# EAGLE design Conduino-V01 (EAGLE 8.5.2)
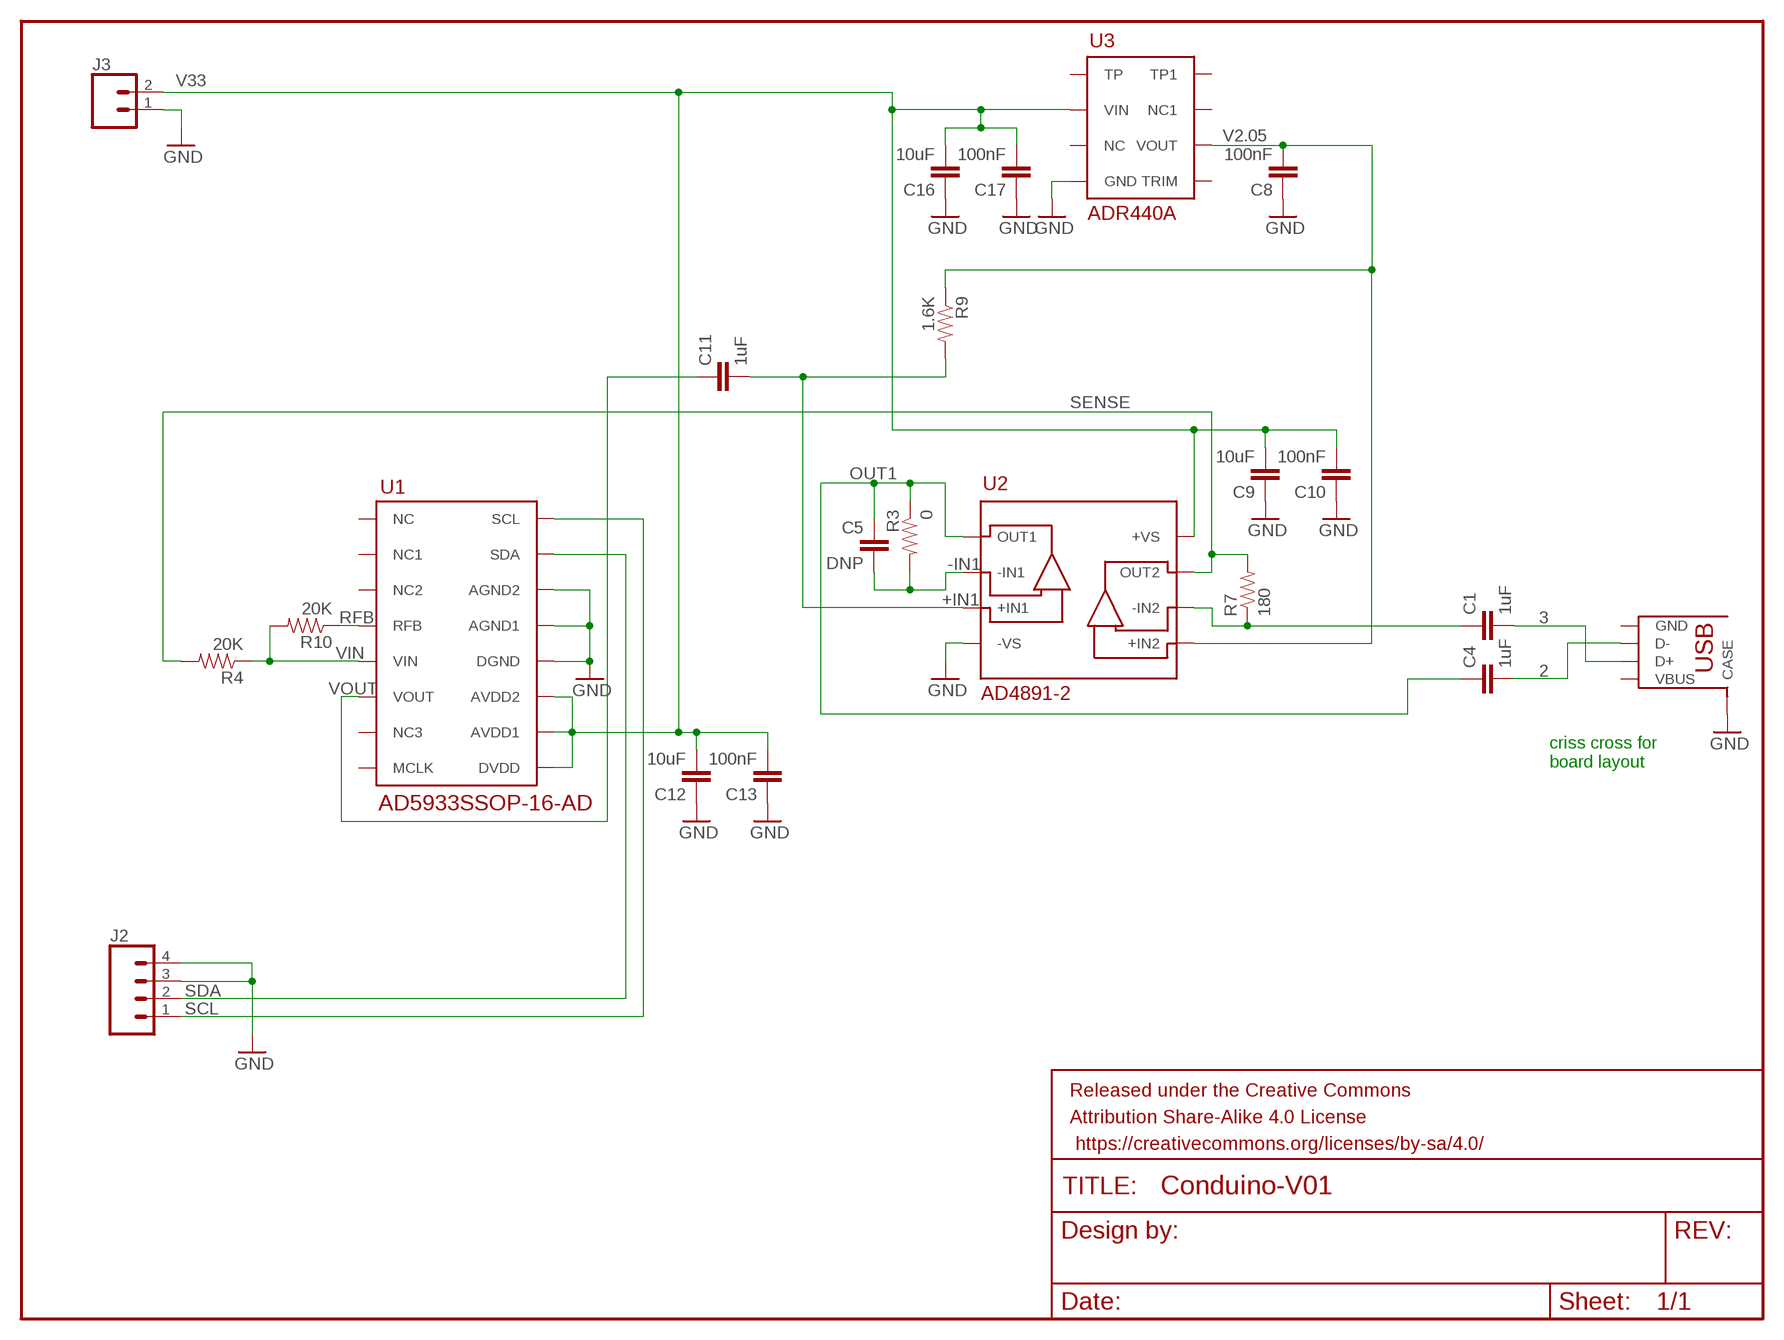
[diagram p0: schematic, sheet 1]

## Parts
C1  1uF  CAP0603-CAP  [0603-CAP]
C4  1uF  CAP0603-CAP  [0603-CAP]
C5  DNP  CAP0603-CAP  [0603-CAP]
C8  100nF  CAP0603-CAP  [0603-CAP]
C9  10uF  CAP0603-CAP  [0603-CAP]
C10  100nF  CAP0603-CAP  [0603-CAP]
C11  1uF  CAP0603-CAP  [0603-CAP]
C12  10uF  CAP0603-CAP  [0603-CAP]
C13  100nF  CAP0603-CAP  [0603-CAP]
C16  10uF  CAP0603-CAP  [0603-CAP]
C17  100nF  CAP0603-CAP  [0603-CAP]
FRAME1  FRAME-LETTER  [CREATIVE_COMMONS]
J1  USBA-SIDE  [USBA-SIDE]
J2  CONN_041X04_NO_SILK  [1X04_NO_SILK]
J3  CONN_021X02_NO_SILK  [1X02_NO_SILK]
R3  0  RESISTOR0603-RES  [0603-RES]
R4  20K  RESISTOR0603-RES  [0603-RES]
R7  180  RESISTOR0603-RES  [0603-RES]
R9  1.6K  RESISTOR0603-RES  [0603-RES]
R10  20K  RESISTOR0603-RES  [0603-RES]
U1  AD5933SSOP-16-AD  [SSOP-16-AD]
U2  AD4891-2  [SOIC_N]
U3  ADR440A  [SOIC_N]

## Nets
2: C4.2 J1.P$2(D-)
3: C1.2 J1.P$3(D+)
+IN1: C11.2 R9.2 U2.P$3(+IN1)
-IN1: C5.2 R3.2 U2.P$2(-IN1)
-IN2: C1.1 R7.1 U2.P$6(-IN2)
GND: C8.1 C9.1 C10.1 C12.1 C13.1 C16.1 C17.1 J1.P$5(CASE) J1.P$6(CASE) J2.3 J2.4 J3.1 U1.P$12(DGND) U1.P$13(AGND1) U1.P$14(AGND2) U2.P$4(-VS) U3.P$4(GND)
OUT1: C4.1 C5.1 R3.1 U2.P$1(OUT1)
RFB: R10.1 U1.P$4(RFB)
SCL: J2.1 U1.P$16(SCL)
SDA: J2.2 U1.P$15(SDA)
SENSE: R4.2 R7.2 U2.P$7(OUT2)
V2.05: C8.2 R9.1 U2.P$5(+IN2) U3.P$6(VOUT)
V33: C9.2 C10.2 C12.2 C13.2 C16.2 C17.2 J3.2 U1.P$9(DVDD) U1.P$10(AVDD1) U1.P$11(AVDD2) U2.P$8(+VS) U3.P$2(VIN)
VIN: R4.1 R10.2 U1.P$5(VIN)
VOUT: C11.1 U1.P$6(VOUT)
Unconnected: J1.P$1(GND) J1.P$4(VBUS) U1.P$1(NC) U1.P$2(NC1) U1.P$3(NC2) U1.P$7(NC3) U1.P$8(MCLK) U3.P$1(TP) U3.P$3(NC) U3.P$5(TRIM) U3.P$7(NC1) U3.P$8(TP1)

## Notes on the sheet
- criss cross for 
  board layout

## Library data of the parts
C1 C4 C5 C8-C13 C16 C17 = SparkFun-Passives:CAP: Capacitor Standard 0603 ceramic capacitor, and 0.1" leaded capacitor.
FRAME1 = SparkFun-Aesthetics:FRAME-LETTER: Schematic Frame Standard 8.5x11 US Letter frame
J1 = KDA:USBA-SIDE
J2 = SparkFun-Connectors:CONN_04: Multi connection point. Often used as Generic Header-pin footprint for 0.1 inch spaced/style header connections On any of the 0.1 inch spaced packages, you can populate with these: Break Away Headers - Straight <https://www.sparkfun.com/products/116> (PRT-00116) Break Away Male Headers - Right Angle <https://www.sparkfun.com/products/553> (PRT-00553) Female Headers <https://www.sparkfun.com/products/115> (PRT-00115) Break Away Headers - Machine Pin <https://www.sparkfun.com/products/117> (PRT-00117) Break Away Female Headers - Swiss Machine Pin <https://www.sparkfun.com/products/743> (PRT-00743) For SCREWTERMINALS and SPRING TERMINALS visit here: Screw Terimnals on SparkFun.com <https://www.sparkfun.com/search/results?term=Screw+Terminals> (5mm/3.5mm/2.54mm spacing) This device is also useful as a general connection point to wire up your design to another part of your project. Our various solder wires solder well into these plated through hole pads. Hook-Up Wire - Assortment (Stranded, 22 AWG) <https://www.sparkfun.com/products/11375> (PRT-11375) Hook-Up Wire - Assortment (Solid Core, 22 AWG) <https://www.sparkfun.com/products/11367> (PRT-11367) View the entire wire category on our website here <https://www.sparkfun.com/categories/141> Special notes: Molex polarized connector foot print use with SKU : PRT-08231 with associated crimp pins and housings. 1MM SMD Version SKU: PRT-10208; PROD_ID: CONN-09696
J3 = SparkFun-Connectors:CONN_02: Multi connection point. Often used as Generic Header-pin footprint for 0.1 inch spaced/style header connections On any of the 0.1 inch spaced packages, you can populate with these: Break Away Headers - Straight <https://www.sparkfun.com/products/116> (PRT-00116) Break Away Male Headers - Right Angle <https://www.sparkfun.com/products/553> (PRT-00553) Female Headers <https://www.sparkfun.com/products/115> (PRT-00115) Break Away Headers - Machine Pin <https://www.sparkfun.com/products/117> (PRT-00117) Break Away Female Headers - Swiss Machine Pin <https://www.sparkfun.com/products/743> (PRT-00743) For SCREWTERMINALS and SPRING TERMINALS visit here: Screw Terimnals on SparkFun.com <https://www.sparkfun.com/search/results?term=Screw+Terminals> (5mm/3.5mm/2.54mm spacing) This device is also useful as a general connection point to wire up your design to another part of your project. Our various solder wires solder well into these plated through hole pads. Hook-Up Wire - Assortment (Stranded, 22 AWG) <https://www.sparkfun.com/products/11375> (PRT-11375) Hook-Up Wire - Assortment (Solid Core, 22 AWG) <https://www.sparkfun.com/products/11367> (PRT-11367) View the entire wire category on our website here <https://www.sparkfun.com/categories/141> Special notes: Molex polarized connector foot print use with: PRT-08233 with associated crimp pins and housings. 2.54_SCREWTERM for use with PRT-10571. 3.5mm Screw Terminal footprints for PRT-08084 5mm Screw Terminal footprints for use with PRT-08432
R3 R4 R7 R9 R10 = SparkFun-Passives:RESISTOR: Resistor Basic schematic elements and footprints for 0603, 1206, and PTH resistors.
U1 = KDA:AD5933
U2 = KDA:AD4891-2
U3 = KDA:ADR440A

## Board
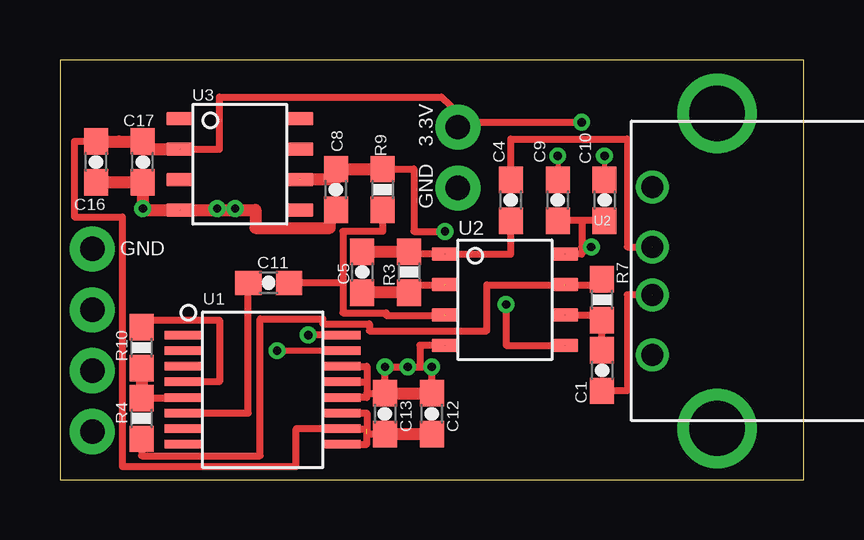
[diagram p1: board, top side]
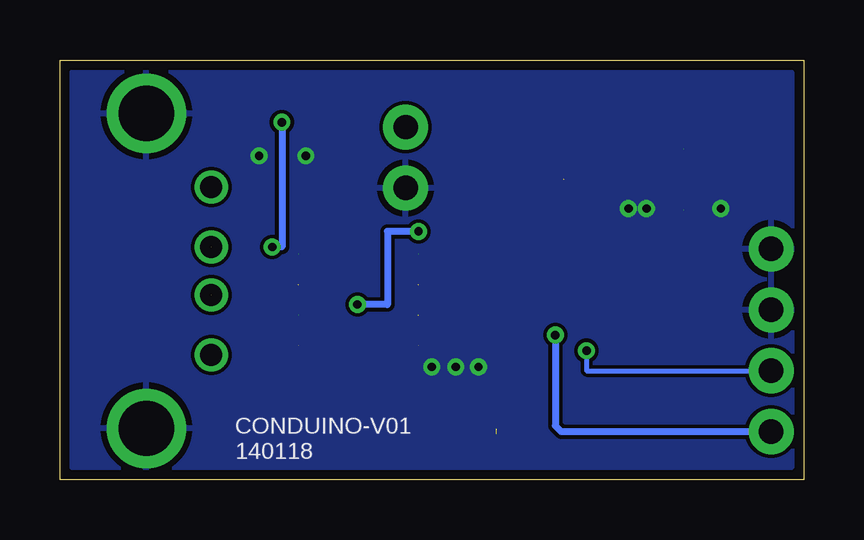
[diagram p2: board, bottom side, seen from below]

Size 31 x 17.5 mm. Coordinates in mm from the lower left corner, seen from the top.
Outline: 0,0 31,0 31,17.5 0,17.5 0,0
Copper layers (1*16): Top 0.0356mm / dielectric 1.5011mm / Bottom 0.0356mm
Design rules "Oshpark_mm": minimum track width 0.15mm, minimum drill 0.33mm, track to track 0.15mm, track to pad 0.15mm, pad to pad 0.15mm, via to via 0.15mm, smd to smd 0.15mm, copper to edge 0.38mm, drill to drill 0.15mm, minimum pad ring 7mil, minimum via ring 7mil, stop-mask expansion 3mil, vias tented up to drill 0mil, thermal gap 10mil

### Footprints (pad centres in the part's own frame; a part is rotated, then mirrored left to right if it is on the bottom)
0603-CAP = smd 1.1 x 1: 1 -0.85,0; 2 0.85,0
USBA-SIDE = drill 0.92: P$1 3.5,2.71; P$2 1,2.71; P$3 -1,2.71; P$4 -3.5,2.71 | drill 2.3: P$5 -6.57,0; P$6 6.57,0
1X04_NO_SILK = drill 1.016 pad 1.88: 1 0,0; 2 2.54,0; 3 5.08,0; 4 7.62,0
1X02_NO_SILK = drill 1.016 pad 1.88: 1 0,0; 2 2.54,0
0603-RES = smd 1.1 x 1: 1 -0.85,0; 2 0.85,0
SSOP-16-AD = smd 1.6 x 0.35: P$1 -3.3,2.275; P$2 -3.3,1.625; P$3 -3.3,0.975; P$4 -3.3,0.325; P$5 -3.3,-0.325; P$6 -3.3,-0.975; P$7 -3.3,-1.625; P$8 -3.3,-2.275; P$9 3.3,-2.275; P$10 3.3,-1.625; P$11 3.3,-0.975; P$12 3.3,-0.325; P$13 3.3,0.325; P$14 3.3,0.975; P$15 3.3,1.625; P$16 3.3,2.275
SOIC_N = smd 1.1 x 0.55: P$1 -2.5,1.905; P$2 -2.5,0.635; P$3 -2.5,-0.635; P$4 -2.5,-1.905; P$5 2.5,-1.905; P$6 2.5,-0.635; P$7 2.5,0.635; P$8 2.5,1.905

### Placement (x,y rotation side)
C1  22.6,4.55 270 top
C4  18.8,11.65 90 top
C5  10pF  [0603-CAP]  12.6,8.65 270 top
C8  11.5,12.1 90 top
C9  20.75,11.65 270 top
C10  22.7,11.65 270 top
C11  8.7,8.2 0 top
C12  15.5,2.75 270 top
C13  13.55,2.75 270 top
C16  1.5,13.25 90 top
C17  3.45,13.25 90 top
FRAME1  0,0 0 top
J1  27.4,8.7 90 top
J2  1.35,2 90 top
J3  16.59,12.16 90 top
R3  150K  [0603-RES]  14.55,8.65 270 top
R4  3.4,2.55 270 top
R7  22.6,7.5 90 top
R9  13.45,12.1 270 top
R10  3.4,5.5 270 top
U1  8.45,3.75 0 top
U2  18.55,7.5 0 top
U3  7.5,13.15 0 top

### Tracks (layer width: path | path; a pad name or v marks a point on that pad's centre or on a via)
2  (1 unrouted)
  Top 0.3: C4.2 18.8,14.2 23.65,14.2 23.65,9.7 J1.P$2
3  (1 unrouted)
  Top 0.3: J1.P$3 23.65,7.7 23.65,3.7 C1.2
+IN1  (1 unrouted)
  Top 0.3: R9.2 13.45,10.35 11.8,10.35 11.8,8.2 | 11.8,8.2 C11.2 | 11.8,8.2 11.8,6.95 13.6,6.95 13.6,6.85 16.05,6.85
-IN1  (1 unrouted)
  Top 0.2: C5.2 12.6,7.92
  Top 0.3: R3.2 14.55,8.12 U2.P$2
  Top 0.5: R3.2 C5.2
-IN2  (1 unrouted)
  Top 0.3: U2.P$6 22.6,6.88 R7.1 C1.1
GND  (via drill 0.35)  (2 unrouted)
  Top 0.2: 12.8,3.6 12.8,3.42 | v20.75,13.5 C9.1 | v22.7,13.5 C10.1 | v7.3,11.3 8.15,11.3 8.15,11.25
  Top 0.3: U1.P$14 12.8,4.72 12.8,4.08 | 12.8,4.08 12.8,3.6 C13.1 v13.55,4.7 v14.5,4.7 15,4.7 | U1.P$13 12.8,4.08 | 12.8,3.42 U1.P$12 | C12.1 v15.5,4.7 15,4.7 | U2.P$4 15,5.6 15,4.7
  Top 0.5: C13.1 C12.1 | C16.1 C17.1 3.45,11.25 U3.P$4 8.15,11.25 8.15,10.5 11.25,10.5 11.25,11.15 C8.1
  other vias: 6.55,11.3 3.45,11.3
  pour Bottom (isolate 0.15): 0.5,17 0.5,0.5 30.5,0.5 30.5,17
OUT1  (1 unrouted)
  Top 0.3: C4.1 18.8,9.4 U2.P$1 14.55,9.4 R3.1
  Top 0.5: R3.1 C5.1
RFB
  Top 0.3: R10.1 3.4,6.65 6.65,6.65 6.65,4.08 U1.P$4
SCL  (via drill 0.35)
  Top 0.3: U1.P$16 v10.35,6.03
  Bottom 0.3: J2.1 10.1,2 10.35,2.25 v10.35,6.03
SDA  (via drill 0.35)
  Top 0.25: U1.P$15 v9.05,5.38
  Bottom 0.2: J2.2 9.05,4.54 v9.05,5.38
SENSE  (1 unrouted)
  Top 0.2: 22.6,8.6 R7.2
  Top 0.3: R4.2 3.4,1 8.35,1 8.35,6.7 10.95,6.7 10.95,6.5 12.9,6.5 12.9,6.2 17.8,6.2 17.8,8.12 U2.P$7 22.6,8.12 R7.2
V2.05  (via drill 0.35)  (2 unrouted)
  Top 0.2: 11.5,12.53 C8.2
  Top 0.3: R9.1 14.75,12.95 14.75,10.35 v16.05,10.35 | v18.6,7.3 18.6,5.6 U2.P$5
  Top 0.5: U3.P$6 11.5,12.53 | C8.2 R9.1
  Bottom 0.3: v16.05,10.35 17.35,10.35 17.35,7.3 v18.6,7.3
V33  (via drill 0.35)  (3 unrouted)
  Top 0.2: 22.7,10.5 C10.2
  Top 0.3: U1.P$11 12.8,2.77 12.8,1.9 | 12.8,1.9 C13.2 | U1.P$9 12.8,1.48 12.8,1.9 | 12.8,2.12 U1.P$10 9.85,2.12 9.85,0.55 2.6,0.55 2.6,10.95 0.6,10.95 0.6,14.1 2.45,14.1 | 5,13.78 6.65,13.78 6.65,15.95 15.9,15.95 16.59,15.3 16.59,14.9 | C10.2 21.75,10.8 | 21.75,10.8 C9.2 | 21.75,10.8 21.75,9.7 | 21.75,9.7 21.75,9.4 U2.P$8 | J3.2 16.59,14.9 | 16.59,14.9 v21.75,14.9 | 21.75,9.7 v22.15,9.7
  Top 0.5: C13.2 C12.2 | C16.2 2.45,14.1 C17.2 3.45,13.78 5,13.78
  Bottom 0.3: v21.75,14.9 21.75,9.7 v22.15,9.7
VIN
  Top 0.2: 5.12,3.4 U1.P$5
  Top 0.3: R4.1 5.12,3.4
  Top 0.5: R10.2 R4.1
VOUT
  Top 0.3: U1.P$6 7.85,2.77 C11.1

### Text on the board
tPlace: U3 | 3.3V | GND | U2 | U2 | GND | U1
bPlace: CONDUINO-V01 | 140118